# EAGLE design nikon-gps (EAGLE 6.5.0)
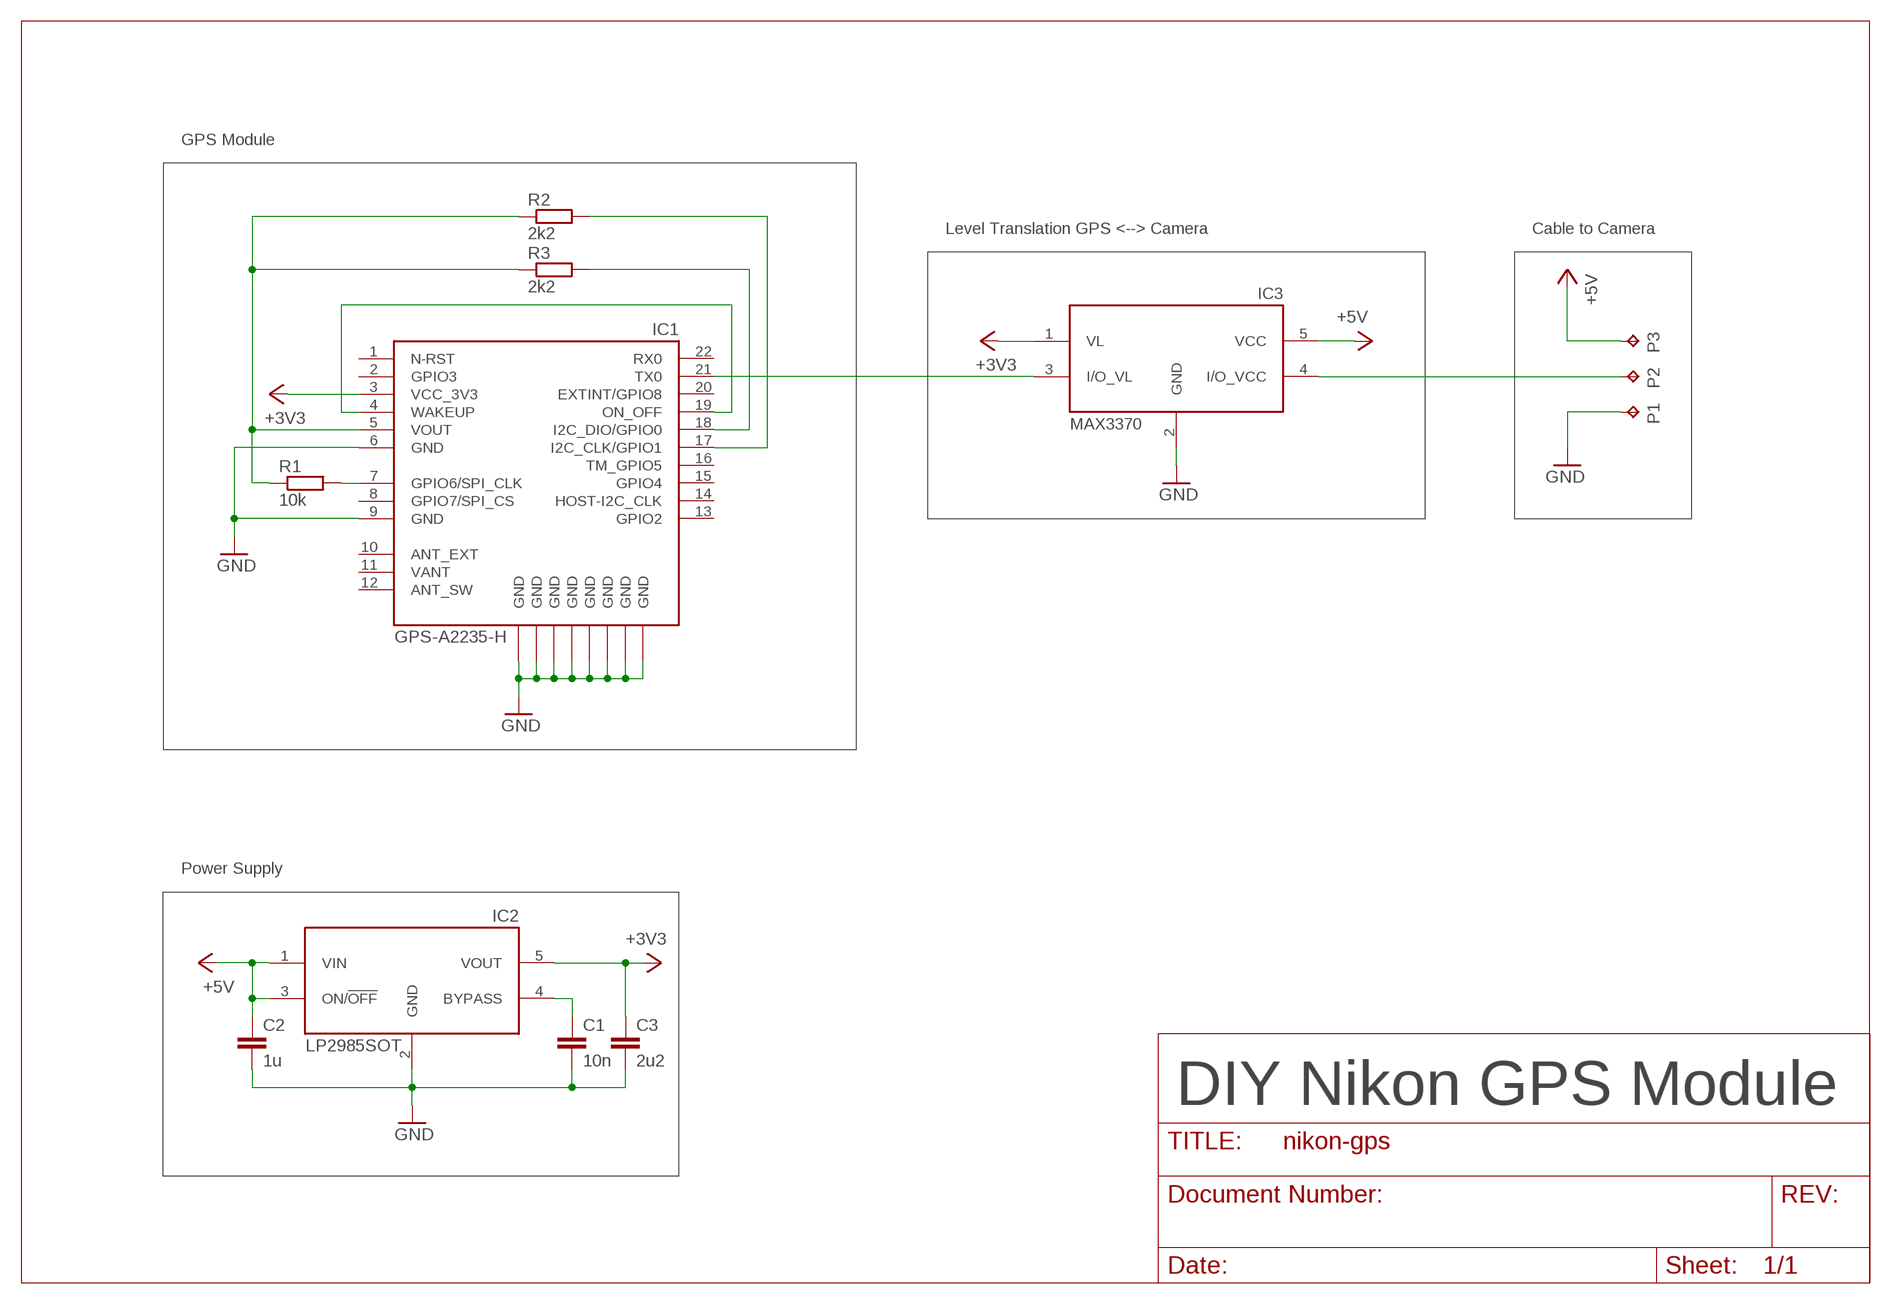
[diagram p0: schematic, sheet 1]

## Parts
C1  10n  C-EUC0805  [C0805]
C2  1u  C-EUC0805  [C0805]
C3  2u2  C-EUC0805  [C0805]
IC1  GPS-A2235-H  [GPS-A2235-H]
IC2  LP2985SOT  [SOT23-5L]
IC3  MAX3370  [SC70-5L]
P1  TPTP12SQ  [TP12SQ]
P2  TPTP12SQ  [TP12SQ]
P3  TPTP12SQ  [TP12SQ]
R1  10k  R-EU_M1206  [M1206]
R2  2k2  R-EU_M1206  [M1206]
R3  2k2  R-EU_M1206  [M1206]

## Nets
+3V3: C3.1 IC1.3(VCC_3V3) IC2.5(VOUT) IC3.1(VL)
+5V: C2.1 IC2.1(VIN) IC2.3(ON/!OFF) IC3.5(VCC) P3.TP
GND: C1.2 C2.2 C3.2 IC1.6(GND) IC1.9(GND) IC1.GND_PAD@1(GND) IC1.GND_PAD@2(GND) IC1.GND_PAD@3(GND) IC1.GND_PAD@4(GND) IC1.GND_PAD@5(GND) IC1.GND_PAD@6(GND) IC1.GND_PAD@7(GND) IC1.GND_PAD@8(GND) IC2.2(GND) IC3.2(GND) P1.TP
N$1: C1.1 IC2.4(BYPASS)
N$2: IC1.21(TX0) IC3.3(I/O_VL)
N$3: IC3.4(I/O_VCC) P2.TP
N$4: IC1.7(GPIO6/SPI_CLK) R1.2
N$5: IC1.18(I2C_DIO/GPIO0) R3.2
N$6: IC1.17(I2C_CLK/GPIO1) R2.2
N$7: IC1.4(WAKEUP) IC1.19(ON_OFF)
VOUT: IC1.5(VOUT) R1.1 R2.1 R3.1
Unconnected: IC1.1(N-RST) IC1.2(GPIO3) IC1.8(GPIO7/SPI_CS) IC1.10(ANT_EXT) IC1.12(ANT_SW) IC1.13(GPIO2) IC1.14(HOST-I2C_CLK) IC1.15(GPIO4) IC1.16(TM_GPIO5) IC1.20(EXTINT/GPIO8) IC1.22(RX0)

## Notes on the sheet
- GPS Module
- Level Translation GPS <--> Camera | Cable to Camera
- Power Supply
- DIY Nikon GPS Module

## Power pins joined to a net without a drawn wire
VANT: IC1.11(VANT)

## Library data of the parts
C1-C3 = rcl:C-EU: CAPACITOR, European symbol
IC1 = selfmade:GPS-A2235-H: Maestro A2235-H GPS Antenna Receiver Module. Available at e.g. Mouser or Farnell (Element14). Datasheet <http://www.specialty-designs.com/gpsmanual.pdf> Design according to User Manual V1.4. Noticable difference: older versions did not feature pins for an external antenna.
IC2 = selfmade:LP2985
IC3 = selfmade:MAX3370
P1-P3 = testpad:TP: Test pad
R1-R3 = rcl:R-EU_: RESISTOR, European symbol

## Board
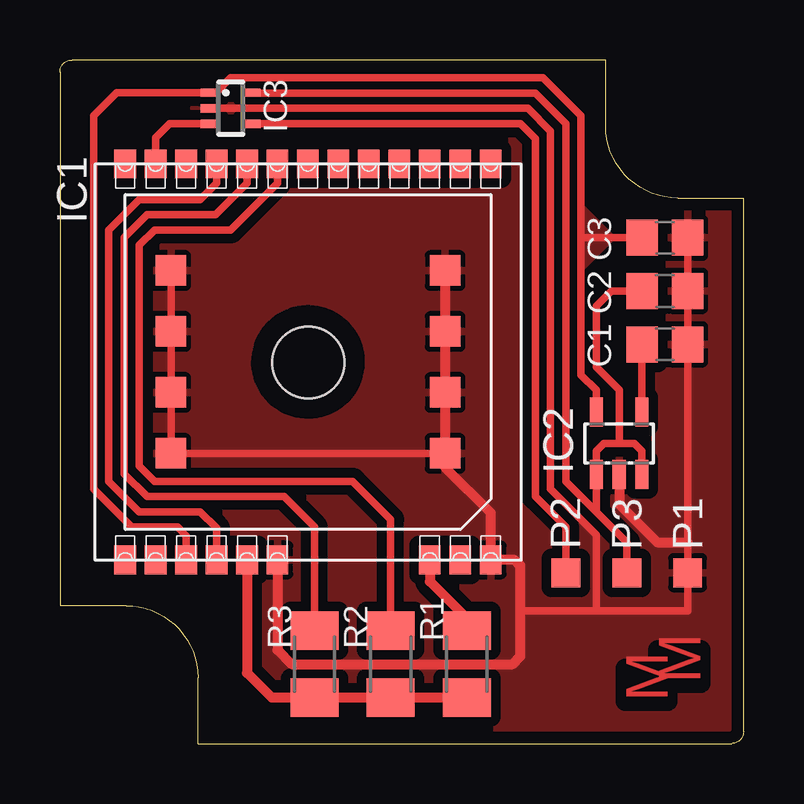
[diagram p1: board, top side]

Size 28.5 x 28.5 mm. Coordinates in mm from the lower left corner, seen from the top.
Outline: 5.75,0 28,0 arc90 28.5,0.5 28.5,22.75 25.75,22.75 arc-90 22.75,25.75 22.75,28.5 0.5,28.5 arc90 0,28 0,5.75 2.75,5.75 arc-90 5.75,2.75 5.75,0
Copper layers (1*16): Top 0.035mm / dielectric 1.5mm / Bottom 0.035mm
Design rules "Eagle-DRU - 1109 - LeitOn - 01 and 02 layers *": minimum track width 6mil, minimum drill 0.3mm, track to track 6mil, track to pad 6mil, pad to pad 6mil, via to via 6mil, smd to smd 6mil, copper to edge 20mil, drill to drill 10mil, minimum pad ring 8mil, minimum via ring 6mil, stop-mask expansion 3mil, vias tented up to drill 0mil, thermal gap 8mil
Holes 3 mm at 10.35,15.89

### Footprints (pad centres in the part's own frame; a part is rotated, then mirrored left to right if it is on the bottom)
C0805 = smd 1.3 x 1.5: 1 -0.95,0; 2 0.95,0
GPS-A2235-H = smd 1.2 x 0.9: 1 -3.81,1.27; 2 -3.81,0; 3 -3.81,-1.27; 4 -3.81,-2.54; 5 -3.81,-3.81; 6 -3.81,-5.08; 7 -3.81,-11.43; 8 -3.81,-12.7; 9 -3.81,-13.97; 10 12.7,-13.97; 11 12.7,-12.7; 12 12.7,-11.43; 13 12.7,-10.16; 14 12.7,-8.89; 15 12.7,-7.62; 16 12.7,-6.35; 17 12.7,-5.08; 18 12.7,-3.81; 19 12.7,-2.54; 20 12.7,-1.27; 21 12.7,0; 22 12.7,1.27 | smd 1.27 x 1.27: GND_PAD@1 0.635,-0.635; GND_PAD@2 3.175,-0.635; GND_PAD@3 5.715,-0.635; GND_PAD@4 8.255,-0.635; GND_PAD@5 8.255,-12.065; GND_PAD@6 5.715,-12.065; GND_PAD@7 3.175,-12.065; GND_PAD@8 0.635,-12.065
SOT23-5L = smd 0.55 x 1.2: 1 -0.95,-1.3; 2 0,-1.3; 3 0.95,-1.3; 4 0.95,1.3; 5 -0.95,1.3
SC70-5L = smd 0.35 x 0.8: 1 -0.65,-0.85; 2 0,-0.85; 3 0.65,-0.85; 4 0.65,0.85; 5 -0.65,0.85
TP12SQ = smd 1.2 x 1.2: TP 0,0
M1206 = smd 1.6 x 2: 1 -1.4,0; 2 1.4,0

### Placement (x,y rotation side)
C1  25.22,16.64 0 top
C2  25.22,18.87 0 top
C3  25.22,21.09 0 top
IC1  3.99,11.46 90 top
IC2  23.31,12.52 0 top
IC3  7.12,26.49 270 top
P1  26.17,7.12 0 top
P2  21.09,7.12 0 top
P3  23.63,7.12 0 top
R1  16.96,3.31 90 top
R2  13.79,3.31 90 top
R3  10.61,3.31 90 top

### Tracks (layer width: path | path; a pad name or v marks a point on that pad's centre or on a via)
+3V3
  Top 0.305: 21.73,21.09 21.73,26.17 20.14,27.76 7.12,27.76 6.5,27.14 IC3.1 2.37,27.14 1.41,26.17 1.41,10.61 2.99,9.03 4.9,9.03 5.26,8.66 IC1.3 | 21.73,21.09 21.73,15.38 22.36,14.74 IC2.5 | C3.1 21.73,21.09
  pour Top: 23,21.09 21.73,19.82 21.73,22.36
+5V
  Top 0.305: IC3.5 7.98,27.12 19.82,27.12 21.09,25.85 21.09,10.93 22.36,9.66 | 22.33,11.25 IC2.1 | IC2.1 22.36,12.2 22.68,12.52 23.31,12.52 | IC2.3 24.26,12.2 23.95,12.52 23.31,12.52 | IC2.1 22.36,9.66 | 22.36,9.66 23.63,8.39 P3.TP | C2.1 23,18.87 22.36,18.23 22.36,15.69 23.31,14.74 23.31,12.52
GND
  Top 0.305: IC3.2 19.5,26.49 20.45,25.54 20.45,10.61 22.36,8.71 22.36,5.53 | IC1.GND_PAD@4 IC1.GND_PAD@3 IC1.GND_PAD@2 IC1.GND_PAD@1 15.52,12.1 16.05,11.56 | 22.36,5.53 19.18,5.53 | 22.36,5.53 26.17,5.53 P1.TP 26.17,8.39 26.17,15.69 C1.2 C2.2 C3.2
  Top 0.406: IC1.6 9.07,3.9 9.66,3.31 18.87,3.31 19.18,3.63 19.18,5.53 19.18,7.44 18.97,7.65 IC1.9 17.96,9.62 16.05,11.52 16.05,11.56 IC1.GND_PAD@8 IC1.GND_PAD@7 IC1.GND_PAD@6 IC1.GND_PAD@5 | IC2.2 23.31,9.98 24.9,8.39 26.17,8.39
  pour Top (isolate 0.406): 0,5.75 0,28 arc-90 0.5,28.5 22.75,28.5 22.75,25.5 arc90 25.5,22.75 28.5,22.75 28.5,0.5 arc-90 28,0 5.75,0 5.75,2.75 arc90 2.75,5.75
N$1
  Top 0.305: IC2.4 C1.1
N$2
  Top 0.305: IC3.3 4.57,25.84 3.99,25.26 IC1.21
N$3
  Top 0.305: IC3.4 19.2,25.84 19.82,25.22 19.82,10.29 21.09,9.03 P2.TP
N$4
  Top 0.406: IC1.7 15.42,6.76 16.96,5.21 R1.2
N$5
  Top 0.305: IC1.18 7.8,23.36 6.49,22.04 3.63,22.04 2.67,21.09 2.67,11.25 3.63,10.29 9.34,10.29 10.61,9.03 R3.2
N$6
  Top 0.305: IC1.17 9.07,23.36 7.12,21.41 3.95,21.41 3.31,20.77 3.31,11.56 3.95,10.93 12.2,10.93 13.79,9.34 R2.2
N$7
  Top 0.305: IC1.19 6.53,23.36 5.85,22.68 3.31,22.68 2.04,21.41 2.04,10.93 3.31,9.66 5.85,9.66 6.53,8.98 IC1.4
VOUT
  Top 0.406: R1.1 R2.1 R3.1 8.84,1.91 7.8,2.95 IC1.5

### Text on the board
Top: M | M